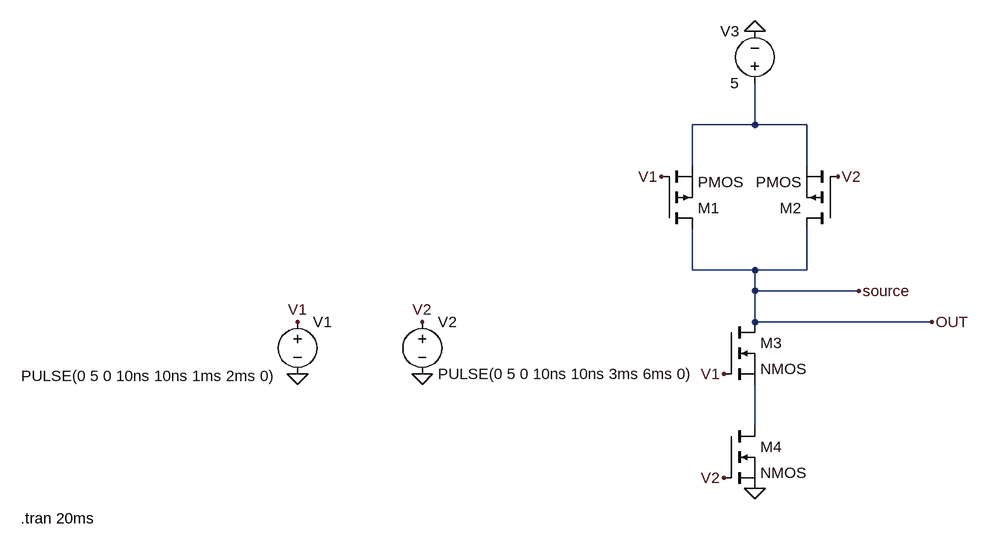
[diagram p0: schematic Porte NAND.asc]
Porte NAND.asc, the LTspice schematic file:
Version 4
SHEET 1 880 680
WIRE 192 -16 192 -80
WIRE 192 -16 96 -16
WIRE 272 -16 192 -16
WIRE 96 48 96 -16
WIRE 272 48 272 -16
WIRE 96 208 96 144
WIRE 192 208 96 208
WIRE 272 208 272 144
WIRE 272 208 192 208
WIRE 192 240 192 208
WIRE 352 240 192 240
WIRE 192 288 192 240
WIRE 464 288 192 288
WIRE 192 448 192 384
FLAG 192 544 0
FLAG -320 368 0
FLAG -512 368 0
FLAG 192 -160 0
FLAG -512 288 V1
FLAG 48 64 V1
FLAG 144 368 V1
FLAG -320 288 V2
FLAG 320 64 V2
FLAG 144 528 V2
FLAG 352 240 source
FLAG 464 288 OUT
SYMBOL pmos 48 144 M180
SYMATTR InstName M1
SYMBOL pmos 320 144 R180
SYMATTR InstName M2
SYMBOL nmos 144 288 R0
SYMATTR InstName M3
SYMBOL nmos 144 448 R0
SYMATTR InstName M4
SYMBOL voltage -512 272 R0
WINDOW 3 -425 99 Left 2
WINDOW 123 0 0 Left 0
WINDOW 39 0 0 Left 0
SYMATTR InstName V1
SYMATTR Value PULSE(0 5 0 10ns 10ns 1ms 2ms 0)
SYMBOL voltage -320 272 R0
WINDOW 123 0 0 Left 0
WINDOW 39 0 0 Left 0
SYMATTR InstName V2
SYMATTR Value PULSE(0 5 0 10ns 10ns 3ms 6ms 0)
SYMBOL voltage 192 -64 R180
WINDOW 0 24 96 Left 2
WINDOW 3 24 16 Left 2
WINDOW 123 0 0 Left 0
WINDOW 39 0 0 Left 0
SYMATTR InstName V3
SYMATTR Value 5
TEXT -938 590 Left 2 !.tran 20ms

The netlist it stands for:
* Porte NAND.asc
M1 OUT V1 N001 N001 PMOS
M2 OUT V2 N001 N001 PMOS
M3 OUT V1 N002 N002 NMOS
M4 N002 V2 0 0 NMOS
V1 V1 0 PULSE(0 5 0 10ns 10ns 1ms 2ms 0)
V2 V2 0 PULSE(0 5 0 10ns 10ns 3ms 6ms 0)
V3 N001 0 5
.model NMOS NMOS
.model PMOS PMOS
.lib standard.mos
.tran 20ms
.backanno
.end